# Altium schematic sheet sheet1.SchDoc
size A3
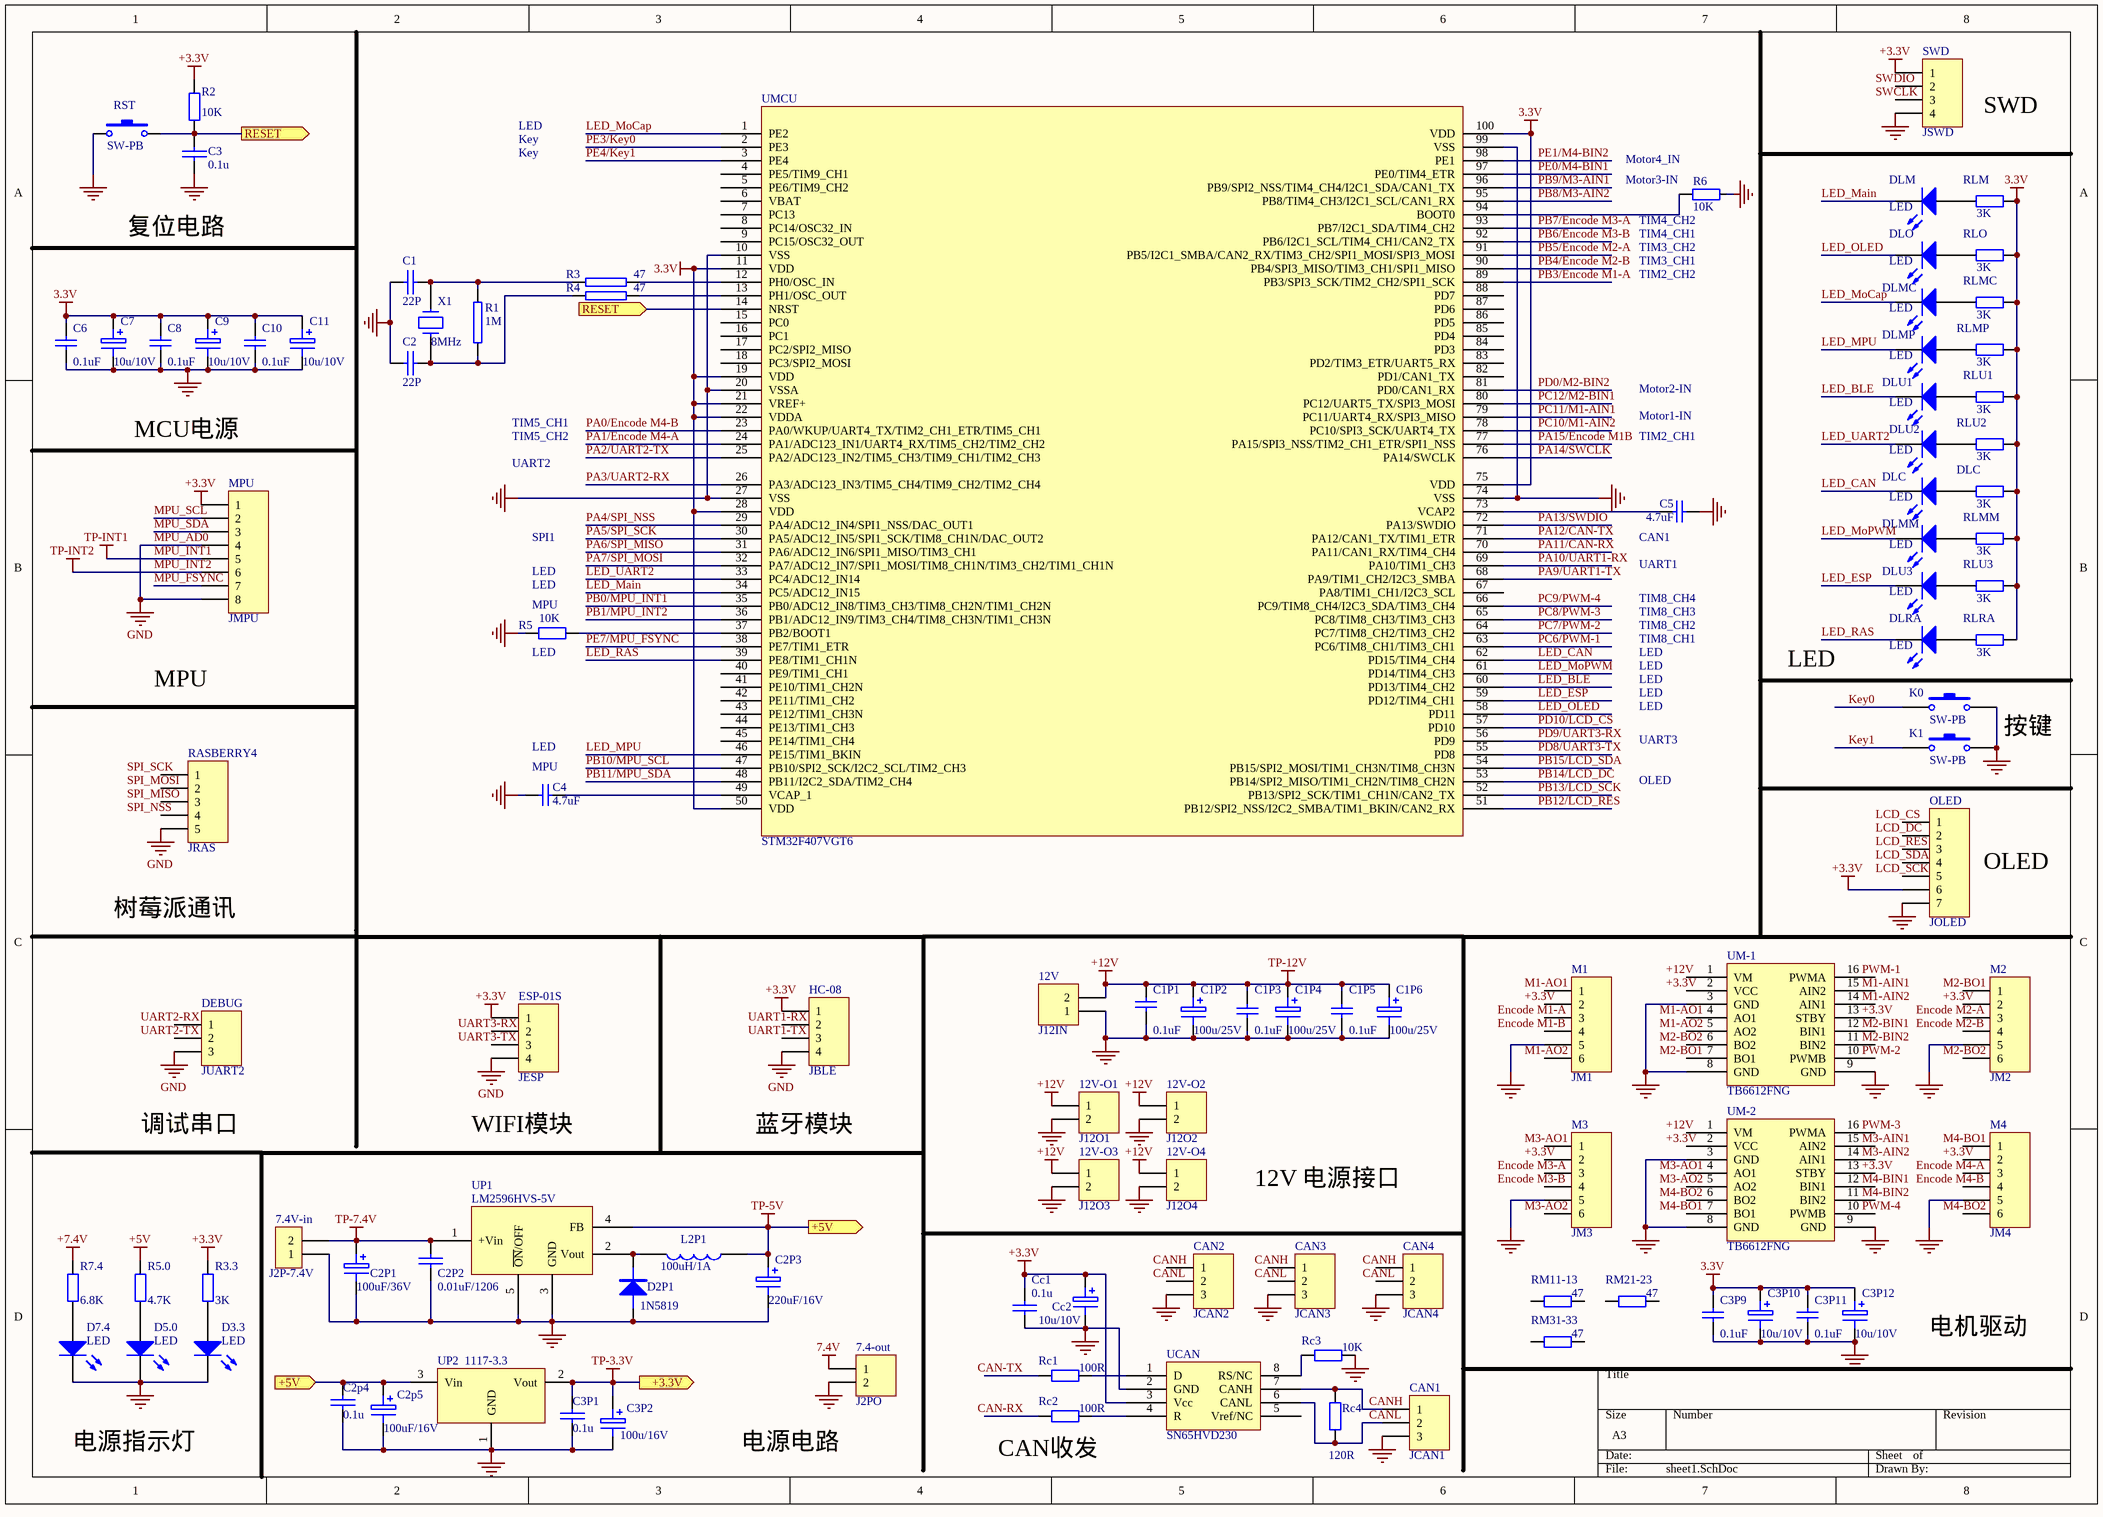
[diagram p0: sheet1.SchDoc]

## Parts
(Parts that share a designator on the sheet are numbered #1, #2 ... from top to bottom, then left to right.)
7.4-out  J2PO  [HDR1X2]
7.4V-in  J2P-7.4V
12V  J12IN  [HDR1X2]
12V-O1  J12O1  [HDR1X2]
12V-O2  J12O2  [HDR1X2]
12V-O3  J12O3  [HDR1X2]
12V-O4  J12O4  [HDR1X2]
C1  22P
C1P1  value 0.1uF  [C1206]  (hidden comment: Cap Semi)
C1P2  100u/25V
C1P3  value 0.1uF  [C1206]  (hidden comment: Cap Semi)
C1P4  100u/25V
C1P5  value 0.1uF  [C1206]  (hidden comment: Cap Semi)
C1P6  100u/25V
C2  22P
C2P1  100uF/36V
C2P2  0.01uF/1206
C2P3  220uF/16V
C2p4  0.1u
C2p5  100uF/16V
C3  0.1u
C3P1  0.1u
C3P2  100u/16V
C3P9  value 0.1uF  [C1206]  (hidden comment: Cap Semi)
C3P10  10u/10V
C3P11  value 0.1uF  [C1206]  (hidden comment: Cap Semi)
C3P12  10u/10V
C4  value 4.7uF  [C1206]  (hidden comment: Cap Semi)
C5  value 4.7uF  [C1206]  (hidden comment: Cap Semi)
C6  value 0.1uF  [C1206]  (hidden comment: Cap Semi)
C7  10u/10V
C8  value 0.1uF  [C1206]  (hidden comment: Cap Semi)
C9  10u/10V
C10  value 0.1uF  [C1206]  (hidden comment: Cap Semi)
C11  10u/10V
CAN1  JCAN1  [HDR1X3]
CAN2  JCAN2  [HDR1X3]
CAN3  JCAN3  [HDR1X3]
CAN4  JCAN4  [HDR1X3]
Cc1  0.1u
Cc2  10u/10V
D2P1  1N5819
D3.3  LED  [3.2X1.6X1.1]
D5.0  LED  [3.2X1.6X1.1]
D7.4  LED  [3.2X1.6X1.1]
DEBUG  JUART2  [HDR1X3]
DLC#1  3K  [AXIAL-0.4]
DLC#2  LED  [3.2X1.6X1.1]
DLM  LED  [3.2X1.6X1.1]
DLMC  LED  [3.2X1.6X1.1]
DLMM  LED  [3.2X1.6X1.1]
DLMP  LED  [3.2X1.6X1.1]
DLO  LED  [3.2X1.6X1.1]
DLRA  LED  [3.2X1.6X1.1]
DLU1  LED  [3.2X1.6X1.1]
DLU2  LED  [3.2X1.6X1.1]
DLU3  LED  [3.2X1.6X1.1]
ESP-01S  JESP  [HDR1X4]
HC-08  JBLE  [HDR1X4]
K0  SW-PB  [SPST-2]
K1  SW-PB  [SPST-2]
L2P1  100uH/1A
M1  JM1  [HDR1X6]
M2  JM2  [HDR1X6]
M3  JM3  [HDR1X6]
M4  JM4  [HDR1X6]
MPU  JMPU  [HDR1X8]
OLED  JOLED  [HDR1X7]
R1  1M
R2  10K  [AXIAL-0.4]
R3  47
R3.3  value 3K  [AXIAL-0.4]  (hidden comment: Res2)
R4  47
R5  10K  [AXIAL-0.4]
R5.0  value 4.7K  [AXIAL-0.4]  (hidden comment: Res2)
R6  10K  [AXIAL-0.4]
R7.4  value 6.8K  [AXIAL-0.4]  (hidden comment: Res2)
RASBERRY4  JRAS  [HDR1X5]
Rc1  value 100R  [AXIAL-0.4]  (hidden comment: Res2)
Rc2  value 100R  [AXIAL-0.4]  (hidden comment: Res2)
Rc3  value 10K  [AXIAL-0.4]  (hidden comment: Res2)
Rc4  value 120R  [AXIAL-0.4]  (hidden comment: Res2)
RLM  3K  [AXIAL-0.4]
RLMC  3K  [AXIAL-0.4]
RLMM  3K  [AXIAL-0.4]
RLMP  3K  [AXIAL-0.4]
RLO  3K  [AXIAL-0.4]
RLRA  3K  [AXIAL-0.4]
RLU1  3K  [AXIAL-0.4]
RLU2  3K  [AXIAL-0.4]
RLU3  3K  [AXIAL-0.4]
RM11-13  value 47  [AXIAL-0.4]  (hidden comment: Res2)
RM21-23  value 47  [AXIAL-0.4]  (hidden comment: Res2)
RM31-33  value 47  [AXIAL-0.4]  (hidden comment: Res2)
RST  SW-PB  [SPST-2]
SWD  JSWD  [HDR1X4]
UCAN  SN65HVD230
UM-1  TB6612FNG
UM-2  TB6612FNG
UMCU  STM32F407VGT6
UP1  LM2596HVS-5V
UP2  1117-3.3
X1  8MHz

## Ports
+3.3V, +5V (in), +5V (out), RESET (in), RESET (out)

## Nets
3.3V: C3P9.2 C3P10.1 C3P11.2 C3P12.1 C6.2 C7.1 C8.2 C9.1 C10.2 C11.1 DLC#1.2 RLM.2 RLMC.2 RLMM.2 RLMP.2 RLO.2 RLRA.2 RLU1.2 RLU2.2 RLU3.2 UMCU.11(VDD) UMCU.19(VDD) UMCU.21(VREF+) UMCU.22(VDDA) UMCU.28(VDD) UMCU.50(VDD) UMCU.75(VDD) UMCU.100(VDD)
7.4V: 7.4-out.1
+3.3V: Cc1.1 Cc2.1 ESP-01S.1 HC-08.1 MPU.1 OLED.6 R2.2 R3.3.2 SWD.1 UCAN.3(Vcc)
+5V: R5.0.2
+7.4V: R7.4.2
+12V: 12V.2 12V-O1.1 12V-O2.1 12V-O3.1 12V-O4.1 C1P1.2 C1P2.1 C1P3.2 C1P4.1 C1P5.2 C1P6.1  [also labelled TP-12V]
MPU_AD0: 7.4-out.2 12V.1 12V-O1.2 12V-O2.2 12V-O3.2 12V-O4.2 C1.1 C1P1.1 C1P2.2 C1P3.1 C1P4.2 C1P5.1 C1P6.2 C2.1 C2p4.2 C2p5.2 C3.1 C3P1.2 C3P2.2 C3P9.1 C3P10.2 C3P11.1 C3P12.2 C4.1 C5.2 C6.1 C7.2 C8.1 C9.2 C10.1 C11.2 CAN1.3 CAN2.3 CAN3.3 CAN4.3 Cc1.2 Cc2.2 D3.3.2(K) D5.0.2(K) D7.4.2(K) DEBUG.3 ESP-01S.4 HC-08.4 K0.2 K1.2 M1.5 M2.5 M3.5 M4.5 MPU.4 MPU.8 OLED.7 R5.1 R6.2 RASBERRY4.5 Rc3.1 SWD.4 UCAN.2(GND) UM-1.3(GND) UM-1.8(GND) UM-1.9(GND) UM-2.3(GND) UM-2.8(GND) UM-2.9(GND) UMCU.10(VSS) UMCU.20(VSSA) UMCU.27(VSS) UMCU.74(VSS) UMCU.99(VSS) UP2.1(GND)  [also labelled GND]
MPU_INT1: MPU.5  [also labelled TP-INT1]
MPU_INT2: MPU.6  [also labelled TP-INT2]
TP-3.3V: C3P1.1 C3P2.1 UP2.2(Vout) ; port +3.3V
TP-5V: C2P3.1 C2p4.1 C2p5.1 L2P1.1 UP1.4(FB) UP2.3(Vin) ; port +5V
TP-7.4V: 7.4V-in.2 C2P1.1 C2P2.1 UP1.1(+Vin)
VCC: 7.4V-in.1 C2P1.2 C2P2.2 C2P3.2 D2P1.1(A) UP1.3(GND) UP1.5(~{ON}/OFF)
CANH: CAN1.1 Rc4.2 UCAN.7(CANH)
CANL: CAN1.2 Rc4.1 UCAN.6(CANL)
Key0: K0.1
Key1: K1.1
LED_BLE: DLU1.2(K) UMCU.60(PD13/TIM4_CH2)
LED_CAN: DLC#2.2(K) UMCU.62(PD15/TIM4_CH4)
LED_ESP: DLU3.2(K) UMCU.59(PD12/TIM4_CH1)
LED_Main: DLM.2(K) UMCU.34(PC5/ADC12_IN15)
LED_MoCap: DLMC.2(K) UMCU.1(PE2)
LED_MoPWM: DLMM.2(K) UMCU.61(PD14/TIM4_CH3)
LED_MPU: DLMP.2(K) UMCU.46(PE15/TIM1_BKIN)
LED_OLED: DLO.2(K) UMCU.58(PD11)
LED_RAS: DLRA.2(K) UMCU.39(PE8/TIM1_CH1N)
LED_UART2: DLU2.2(K) UMCU.33(PC4/ADC12_IN14)
MPU_FSYNC: MPU.7
MPU_SCL: MPU.2
MPU_SDA: MPU.3
PA0/Encode M4-B: UMCU.23(PA0/WKUP/UART4_TX/TIM2_CH1_ETR/TIM5_CH1)
PA1/Encode M4-A: UMCU.24(PA1/ADC123_IN1/UART4_RX/TIM5_CH2/TIM2_CH2)
PA2/UART2-TX: UMCU.25(PA2/ADC123_IN2/TIM5_CH3/TIM9_CH1/TIM2_CH3)
PA3/UART2-RX: UMCU.26(PA3/ADC123_IN3/TIM5_CH4/TIM9_CH2/TIM2_CH4)
PA4/SPI_NSS: UMCU.29(PA4/ADC12_IN4/SPI1_NSS/DAC_OUT1)
PA5/SPI_SCK: UMCU.30(PA5/ADC12_IN5/SPI1_SCK/TIM8_CH1N/DAC_OUT2)
PA6/SPI_MISO: UMCU.31(PA6/ADC12_IN6/SPI1_MISO/TIM3_CH1)
PA7/SPI_MOSI: UMCU.32(PA7/ADC12_IN7/SPI1_MOSI/TIM8_CH1N/TIM3_CH2/TIM1_CH1N)
PA9/UART1-TX: UMCU.68(PA9/TIM1_CH2/I2C3_SMBA)
PA10/UART1-RX: UMCU.69(PA10/TIM1_CH3)
PA11/CAN-RX: UMCU.70(PA11/CAN1_RX/TIM4_CH4)
PA12/CAN-TX: UMCU.71(PA12/CAN1_TX/TIM1_ETR)
PA13/SWDIO: UMCU.72(PA13/SWDIO)
PA14/SWCLK: UMCU.76(PA14/SWCLK)
PA15/Encode M1B: UMCU.77(PA15/SPI3_NSS/TIM2_CH1_ETR/SPI1_NSS)
PB0/MPU_INT1: UMCU.35(PB0/ADC12_IN8/TIM3_CH3/TIM8_CH2N/TIM1_CH2N)
PB1/MPU_INT2: UMCU.36(PB1/ADC12_IN9/TIM3_CH4/TIM8_CH3N/TIM1_CH3N)
PB3/Encode M1-A: UMCU.89(PB3/SPI3_SCK/TIM2_CH2/SPI1_SCK)
PB4/Encode M2-B: UMCU.90(PB4/SPI3_MISO/TIM3_CH1/SPI1_MISO)
PB5/Encode M2-A: UMCU.91(PB5/I2C1_SMBA/CAN2_RX/TIM3_CH2/SPI1_MOSI/SPI3_MOSI)
PB6/Encode M3-B: UMCU.92(PB6/I2C1_SCL/TIM4_CH1/CAN2_TX)
PB7/Encode M3-A: UMCU.93(PB7/I2C1_SDA/TIM4_CH2)
PB8/M3-AIN2: UMCU.95(PB8/TIM4_CH3/I2C1_SCL/CAN1_RX)
PB9/M3-AIN1: UMCU.96(PB9/SPI2_NSS/TIM4_CH4/I2C1_SDA/CAN1_TX)
PB10/MPU_SCL: UMCU.47(PB10/SPI2_SCK/I2C2_SCL/TIM2_CH3)
PB11/MPU_SDA: UMCU.48(PB11/I2C2_SDA/TIM2_CH4)
PB12/LCD_RES: UMCU.51(PB12/SPI2_NSS/I2C2_SMBA/TIM1_BKIN/CAN2_RX)
PB13/LCD_SCK: UMCU.52(PB13/SPI2_SCK/TIM1_CH1N/CAN2_TX)
PB14/LCD_DC: UMCU.53(PB14/SPI2_MISO/TIM1_CH2N/TIM8_CH2N)
PB15/LCD_SDA: UMCU.54(PB15/SPI2_MOSI/TIM1_CH3N/TIM8_CH3N)
PC6/PWM-1: UMCU.63(PC6/TIM8_CH1/TIM3_CH1)
PC7/PWM-2: UMCU.64(PC7/TIM8_CH2/TIM3_CH2)
PC8/PWM-3: UMCU.65(PC8/TIM8_CH3/TIM3_CH3)
PC9/PWM-4: UMCU.66(PC9/TIM8_CH4/I2C3_SDA/TIM3_CH4)
PC10/M1-AIN2: UMCU.78(PC10/SPI3_SCK/UART4_TX)
PC11/M1-AIN1: UMCU.79(PC11/UART4_RX/SPI3_MISO)
PC12/M2-BIN1: UMCU.80(PC12/UART5_TX/SPI3_MOSI)
PD0/M2-BIN2: UMCU.81(PD0/CAN1_RX)
PD8/UART3-TX: UMCU.55(PD8)
PD9/UART3-RX: UMCU.56(PD9)
PD10/LCD_CS: UMCU.57(PD10)
PE0/M4-BIN1: UMCU.97(PE0/TIM4_ETR)
PE1/M4-BIN2: UMCU.98(PE1)
PE3/Key0: UMCU.2(PE3)
PE4/Key1: UMCU.3(PE4)
PE7/MPU_FSYNC: UMCU.38(PE7/TIM1_ETR)
RESET: C3.2 R2.1 RST.2 UMCU.14(NRST) ; port RESET
NetC1_2: C1.2 R1.2 R3.2 X1.2
NetC2_2: C2.2 R1.1 R4.2 X1.1
NetC4_2: C4.2 UMCU.49(VCAP_1)
NetC5_1: C5.1 UMCU.73(VCAP2)
NetD2P1_2: D2P1.2(K) L2P1.2 UP1.2(Vout)
NetD3.3_1: D3.3.1(A) R3.3.1
NetD5.0_1: D5.0.1(A) R5.0.1
NetD7.4_1: D7.4.1(A) R7.4.1
NetDLC#1_1: DLC#1.1 DLC#2.1(A)
NetDLM_1: DLM.1(A) RLM.1
NetDLMC_1: DLMC.1(A) RLMC.1
NetDLMM_1: DLMM.1(A) RLMM.1
NetDLMP_1: DLMP.1(A) RLMP.1
NetDLO_1: DLO.1(A) RLO.1
NetDLRA_1: DLRA.1(A) RLRA.1
NetDLU1_1: DLU1.1(A) RLU1.1
NetDLU2_1: DLU2.1(A) RLU2.1
NetDLU3_1: DLU3.1(A) RLU3.1
NetR3_1: R3.1 UMCU.12(PH0/OSC_IN)
NetR4_1: R4.1 UMCU.13(PH1/OSC_OUT)
NetR5_2: R5.2 UMCU.37(PB2/BOOT1)
NetR6_1: R6.1 UMCU.94(BOOT0)
NetRc1_1: Rc1.1 UCAN.1(D)
NetRc2_1: Rc2.1 UCAN.4(R)
NetRc3_2: Rc3.2 UCAN.8(RS/NC)

Not connected (* = marked no-connect by the designer): CAN2 1 2; CAN3 1 2; CAN4 1 2; DEBUG 1 2; ESP-01S 2 3; HC-08 2 3; M1 1 2 3 4 6; M2 1 2 3 4 6; M3 1 2 3 4 6; M4 1 2 3 4 6; OLED 1 2 3 4 5; RASBERRY4 1 2 3 4; Rc1 2; Rc2 2; RM11-13 1 2; RM21-23 1 2; RM31-33 1 2; RST 1; SWD 2 3; UCAN 5(Vref/NC); UM-1 1(VM) 2(VCC) 4(AO1) 5(AO2) 6(BO2) 7(BO1) 10(PWMB) 11(BIN2) 12(BIN1) 13(STBY) 14(AIN1) 15(AIN2) 16(PWMA); UM-2 1(VM) 2(VCC) 4(AO1) 5(AO2) 6(BO2) 7(BO1) 10(PWMB) 11(BIN2) 12(BIN1) 13(STBY) 14(AIN1) 15(AIN2) 16(PWMA); UMCU 4(PE5/TIM9_CH1) 5(PE6/TIM9_CH2) 6(VBAT) 7(PC13) 8(PC14/OSC32_IN) 9(PC15/OSC32_OUT) 15(PC0) 16(PC1) 17(PC2/SPI2_MISO) 18(PC3/SPI2_MOSI) 40(PE9/TIM1_CH1) 41(PE10/TIM1_CH2N) 42(PE11/TIM1_CH2) 43(PE12/TIM1_CH3N) 44(PE13/TIM1_CH3) 45(PE14/TIM1_CH4) 67(PA8/TIM1_CH1/I2C3_SCL) 82(PD1/CAN1_TX) 83(PD2/TIM3_ETR/UART5_RX) 84(PD3) 85(PD4) 86(PD5) 87(PD6) 88(PD7)

## Notes on the sheet
- Key
- LED
- (near R6) Motor4_IN
- (near R6) Motor3-IN
- SWD
- 复位电路
- (near R6) TIM4_CH2
- (near R6) TIM4_CH1
- (near R6) TIM3_CH2
- TIM3_CH1
- TIM2_CH2
- MCU电源
- TIM5_CH2
- TIM5_CH1
- TIM2_CH1
- Motor1-IN
- Motor2-IN
- UART2
- SPI1
- (near R5) LED
- (near C5) CAN1
- (near C5) UART1
- (near R5) MPU
- TIM8_CH1
- TIM8_CH2
- TIM8_CH3
- TIM8_CH4
- MPU
- (near C4) MPU
- (near C4) LED
- UART3
- OLED
- 按键
- 树莓派通讯
- 调试串口
- WIFI模块
- 蓝牙模块
- 12V 电源接口
- 电机驱动
- 电源指示灯
- 电源电路
- (near Rc2) CAN收发
- Labels drawn without touching a wire or pin: +3.3V, +12V, CAN-RX, CAN-TX, CANH, CANL, Encode M1-A, Encode M1-B, Encode M2-A, Encode M2-B, Encode M3-A, Encode M3-B, Encode M4-A, Encode M4-B, LCD_CS, LCD_DC, LCD_RES, LCD_SCK, LCD_SDA, M1-AIN1, M1-AIN2, M1-AO1, M1-AO2, M2-BIN1, M2-BIN2, M2-BO1, M2-BO2, M3-AIN1, M3-AIN2, M3-AO1, M3-AO2, M4-BIN1, M4-BIN2, M4-BO1, M4-BO2, PWM-1, PWM-2, PWM-3, PWM-4, SPI_MISO, SPI_MOSI, SPI_NSS, SPI_SCK, SWCLK, SWDIO, UART1-RX, UART1-TX, UART2-RX, UART2-TX, UART3-RX, UART3-TX

## Library data of the parts
7.4-out 12V 12V-O1-12V-O4 = Header 2: Header, 2-Pin; LatestRevisionDate: 17-Jul-2002; LatestRevisionNote: Re-released for DXP Platform.; Publisher: Altium Limited
7.4V-in = CON2: Connector
C1 C2 C2P2 C2p4 C3 C3P1 Cc1 = CAP: Capacitor
C1P1 C1P3 C1P5 C3P9 C3P11 C4-C6 C8 C10 = Cap Semi: Capacitor (Semiconductor SIM Model); Published: 8-Jun-2000; LatestRevisionDate: 29-May-2009; LatestRevisionNote: IPC-7351 Footprint Added.; PackageReference: C1206; Publisher: Altium Limited; PackageDescription: Chip Capacitor
C1P2 C1P4 C1P6 C2P1 C2P3 C2p5 C3P2 C3P10 C3P12 C7 C9 C11 Cc2 = ELECTRO1: Electrolytic Capacitor
CAN1-CAN4 DEBUG = Header 3: Header, 3-Pin; LatestRevisionDate: 17-Jul-2002; LatestRevisionNote: Re-released for DXP Platform.; Publisher: Altium Limited
D2P1 = DIODE
D3.3 D5.0 D7.4 DLC#2 DLM DLMC DLMM DLMP DLO DLRA DLU1-DLU3 = LED2: Typical RED, GREEN, YELLOW, AMBER GaAs LED; Published: 8-Jun-2000; LatestRevisionDate: 17-Jul-2002; LatestRevisionNote: Re-released for DXP Platform.; PackageVersion: Feb-2002; PackageReference: 3.2X1.6X1.1; Publisher: Altium Limited; PackageDescription: SM LED; 2 Flat Leads
DLC#1 R2 R3.3 R5 R5.0 R6 R7.4 Rc1-Rc4 RLM RLMC RLMM RLMP RLO RLRA RLU1-RLU3 RM11-13 RM21-23 RM31-33 = Res2: Resistor; Published: 8-Jun-2000; LatestRevisionDate: 17-Jul-2002; LatestRevisionNote: Re-released for DXP Platform.; PackageReference: AXIAL-0.4; Publisher: Altium Limited; PackageDescription: Axial Device, Thru-Hole; 2 Leads; 0.4 in Pin Spacing
  DLC#1 RLM RLMC RLMM RLMP RLO RLRA RLU1-RLU3: Value: 3K
  R2 R5 R6: Value: 10K
ESP-01S HC-08 SWD = Header 4: Header, 4-Pin; LatestRevisionDate: 17-Jul-2002; LatestRevisionNote: Re-released for DXP Platform.; Publisher: Altium Limited
K0 K1 RST = SW-PB: Switch; Published: 24-Mar-1999; LatestRevisionDate: 17-Jul-2002; LatestRevisionNote: Re-released for DXP Platform.; PackageReference: SPST-2; Publisher: Altium Limited
  K0 K1: PackageDescription: Switch; 2 Leads
L2P1 = INDUCTOR1
M1-M4 = Header 6: Header, 6-Pin; LatestRevisionDate: 17-Jul-2002; LatestRevisionNote: Re-released for DXP Platform.; Publisher: Altium Limited
MPU = Header 8: Header, 8-Pin; LatestRevisionDate: 17-Jul-2002; LatestRevisionNote: Re-released for DXP Platform.; Publisher: Altium Limited
OLED = Header 7: Header, 7-Pin; LatestRevisionDate: 17-Jul-2002; LatestRevisionNote: Re-released for DXP Platform.; Publisher: Altium Limited
R1 R3 R4 = RES2
RASBERRY4 = Header 5: Header, 5-Pin; LatestRevisionDate: 17-Jul-2002; LatestRevisionNote: Re-released for DXP Platform.; Publisher: Altium Limited
UMCU = STM32F407xx
X1 = CRYSTAL